# EAGLE design CC Debugger (EAGLE 6.4)
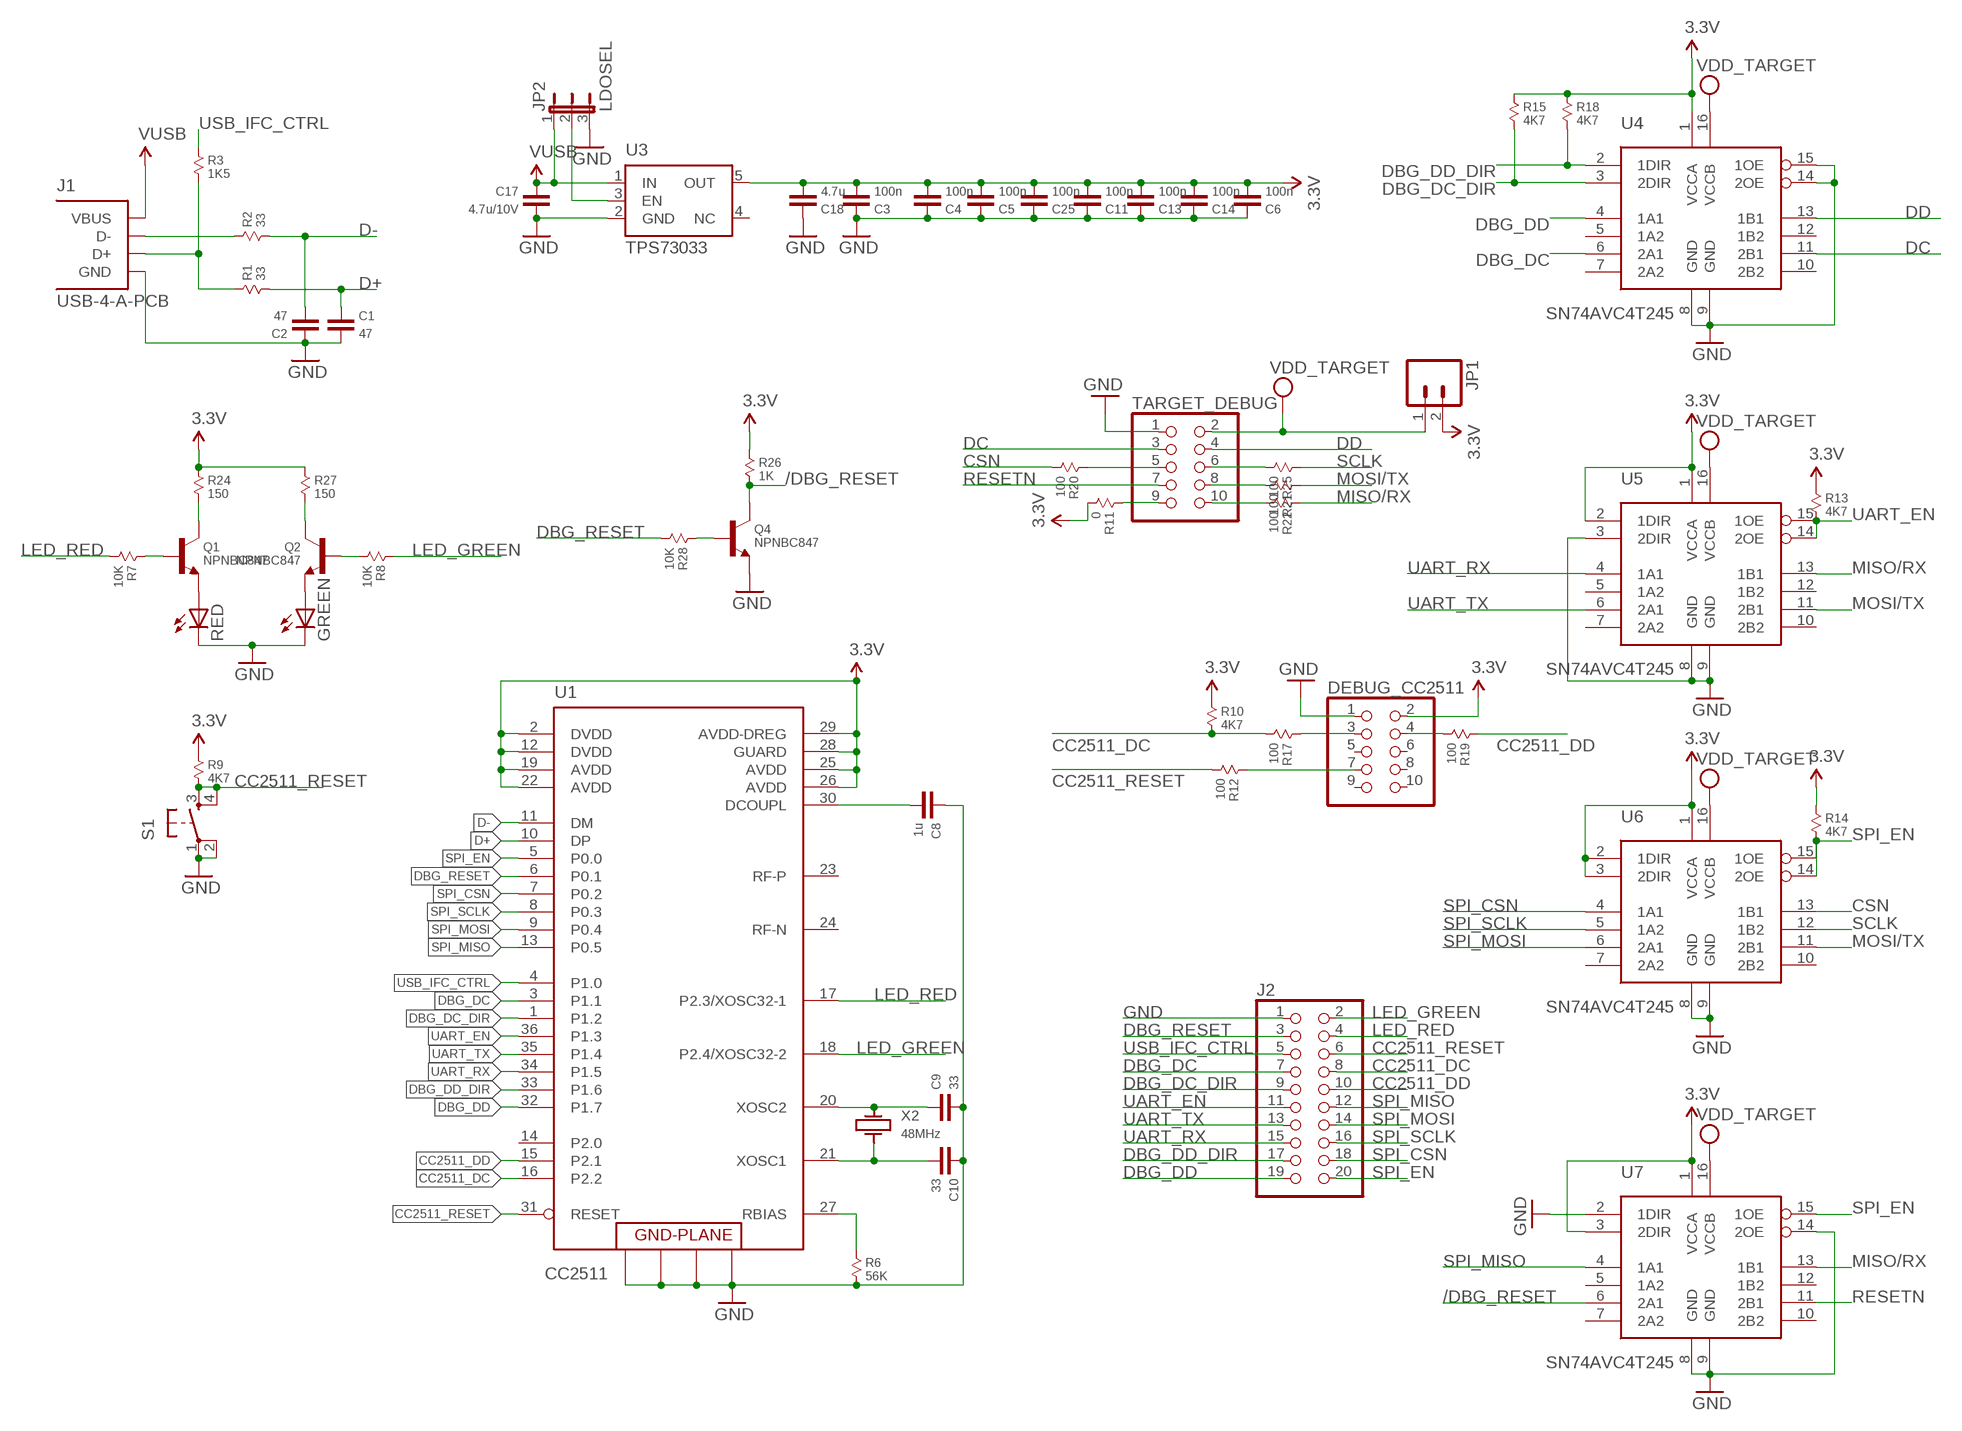
[diagram p0: schematic, sheet 1]

## Parts
C1  47  CAP-0603  [0603]
C2  47  CAP-0603  [0603]
C3  100n  CAP-0603  [0603]
C4  100n  CAP-0603  [0603]
C5  100n  CAP-0603  [0603]
C6  100n  CAP-0603  [0603]
C8  1u  CAP-0603  [0603]
C9  33  CAP-0603  [0603]
C10  33  CAP-0603  [0603]
C11  100n  CAP-0603  [0603]
C13  100n  CAP-0603  [0603]
C14  100n  CAP-0603  [0603]
C17  4.7u/10V  CAP-0603  [0603]
C18  4.7u  CAP-0603  [0603]
C25  100n  CAP-0603  [0603]
DEBUG_CC2511  PINHD-2X5  [2X05]
GREEN  LEDCHIPLED_0805  [CHIPLED_0805]
J1  USB-4-A-PCB  [USB-A-PCB]
J2  PINHD-2X10  [2X10]
JP1  M02PTH  [1X02]
JP2  LDOSEL  JUMPER-3SMD  [SJ_3]
Q1  NPNBC847  [SOT-23]
Q2  NPNBC847  [SOT-23]
Q4  NPNBC847  [SOT-23]
R1  33  RESISTOR-0603  [0603]
R2  33  RESISTOR-0603  [0603]
R3  1K5  RESISTOR-0603  [0603]
R6  56K  RESISTOR-0603  [0603]
R7  10K  RESISTOR-0603  [0603]
R8  10K  RESISTOR-0603  [0603]
R9  4K7  RESISTOR-0603  [0603]
R10  4K7  RESISTOR-0603  [0603]
R11  0  RESISTOR-0603  [0603]
R12  100  RESISTOR-0603  [0603]
R13  4K7  RESISTOR-0603  [0603]
R14  4K7  RESISTOR-0603  [0603]
R15  4K7  RESISTOR-0603  [0603]
R17  100  RESISTOR-0603  [0603]
R18  4K7  RESISTOR-0603  [0603]
R19  100  RESISTOR-0603  [0603]
R20  100  RESISTOR-0603  [0603]
R21  100  RESISTOR-0603  [0603]
R22  100  RESISTOR-0603  [0603]
R24  150  RESISTOR-0603  [0603]
R25  100  RESISTOR-0603  [0603]
R26  1K  RESISTOR-0603  [0603]
R27  150  RESISTOR-0603  [0603]
R28  10K  RESISTOR-0603  [0603]
RED  LEDCHIPLED_0805  [CHIPLED_0805]
S1  TAC_SWITCHPTH  [TACTILE-PTH]
TARGET_DEBUG  PINHD-2X5  [2X05]
U1  CC2511  [QLP-36]
U3  TPS73033  [SOT23-5]
U4  SN74AVC4T245  [TSSOP16]
U5  SN74AVC4T245  [TSSOP16]
U6  SN74AVC4T245  [TSSOP16]
U7  SN74AVC4T245  [TSSOP16]
X2  48MHz  CRYSTAL-KX-9A  [KX-9A]

## Nets
3.3V: C3.1 C4.1 C5.1 C6.1 C11.1 C13.1 C14.1 C18.1 C25.1 DEBUG_CC2511.2 JP1.2 R9.1 R10.1 R11.2 R13.1 R14.1 R15.1 R18.1 R24.1 R26.1 R27.1 U1.2(DVDD) U1.12(DVDD) U1.19(AVDD) U1.22(AVDD) U1.25(AVDD) U1.26(AVDD) U1.28(GUARD) U1.29(AVDD-DREG) U3.5(OUT) U4.1(VCCA) U5.1(VCCA) U5.2(1DIR) U6.1(VCCA) U6.2(1DIR) U6.3(2DIR) U7.1(VCCA) U7.3(2DIR)
5V: C17.2 J1.VUSB(VBUS) JP2.1 U3.1(IN) ; supply symbol labelled VUSB
/DBG_RESET: Q4.3(C) R26.2 U7.6(2A1)
CC2511_DC: J2.8 R10.2 R17.2 U1.16(P2.2)
CC2511_DD: J2.10 R19.1 U1.15(P2.1)
CC2511_RESET: J2.6 R9.2 R12.2 S1.3 S1.4 U1.31(RESET)
CSN: R20.2 U6.13(1B1)
D+: C1.2 R1.2 U1.10(DP)
D-: C2.1 R2.2 U1.11(DM)
DBG_DC: J2.7 U1.3(P1.1) U4.6(2A1)
DBG_DC_DIR: J2.9 R15.2 U1.1(P1.2) U4.3(2DIR)
DBG_DD: J2.19 U1.32(P1.7) U4.4(1A1)
DBG_DD_DIR: J2.17 R18.2 U1.33(P1.6) U4.2(1DIR)
DBG_RESET: J2.3 R28.2 U1.6(P0.1)
DC: TARGET_DEBUG.3 U4.11(2B1)
DD: TARGET_DEBUG.4 U4.13(1B1)
GND: C1.1 C2.2 C3.2 C4.2 C5.2 C6.2 C8.2 C9.1 C10.2 C11.2 C13.2 C14.2 C17.1 C18.2 C25.2 DEBUG_CC2511.1 GREEN.C J1.GND J2.1 JP2.3 Q4.2(E) R6.2 RED.C S1.1 S1.2 TARGET_DEBUG.1 U1.37(GND) U1.38(GND) U1.39(GND) U1.40(GND) U3.2(GND) U4.8(GND) U4.9(GND) U4.14(2OE) U4.15(1OE) U5.3(2DIR) U5.8(GND) U5.9(GND) U6.8(GND) U6.9(GND) U7.2(1DIR) U7.8(GND) U7.9(GND) U7.14(2OE)
LED_GREEN: J2.2 R8.1 U1.18(P2.4/XOSC32-2)
LED_RED: J2.4 R7.2 U1.17(P2.3/XOSC32-1)
MISO/RX: R22.1 U5.13(1B1) U7.13(1B1)
MOSI/TX: R21.1 U5.11(2B1) U6.11(2B1)
N$2: J1.D- R2.1
N$3: J1.D+ R1.1 R3.2
N$4: GREEN.A Q2.2(E)
N$5: Q1.2(E) RED.A
N$6: Q2.3(C) R27.2
N$7: Q1.3(C) R24.2
N$8: Q2.1(B) R8.2
N$9: DEBUG_CC2511.3 R17.1
N$10: Q1.1(B) R7.1
N$11: DEBUG_CC2511.7 R12.1
N$12: DEBUG_CC2511.4 R19.2
N$13: R25.2 TARGET_DEBUG.6
N$14: C9.2 U1.20(XOSC2) X2.1
N$15: R21.2 TARGET_DEBUG.8
N$16: R22.2 TARGET_DEBUG.10
N$17: C10.1 U1.21(XOSC1) X2.3
N$18: R6.1 U1.27(RBIAS)
N$19: C8.1 U1.30(DCOUPL)
N$20: R11.1 TARGET_DEBUG.9
N$21: R20.1 TARGET_DEBUG.5
N$22: Q4.1(B) R28.1
N$23: JP2.2 U3.3(EN)
RESETN: TARGET_DEBUG.7 U7.11(2B1)
SCLK: R25.1 U6.12(1B2)
SPI_CSN: J2.18 U1.7(P0.2) U6.4(1A1)
SPI_EN: J2.20 R14.2 U1.5(P0.0) U6.14(2OE) U6.15(1OE) U7.15(1OE)
SPI_MISO: J2.12 U1.13(P0.5) U7.4(1A1)
SPI_MOSI: J2.14 U1.9(P0.4) U6.6(2A1)
SPI_SCLK: J2.16 U1.8(P0.3) U6.5(1A2)
UART_EN: J2.11 R13.2 U1.36(P1.3) U5.14(2OE) U5.15(1OE)
UART_RX: J2.15 U1.34(P1.5) U5.4(1A1)
UART_TX: J2.13 U1.35(P1.4) U5.6(2A1)
USB_IFC_CTRL: J2.5 R3.1 U1.4(P1.0)
VDD: JP1.1 TARGET_DEBUG.2 U4.16(VCCB) U5.16(VCCB) U6.16(VCCB) U7.16(VCCB) ; supply symbol labelled VDD_TARGET
Unconnected: DEBUG_CC2511.5 DEBUG_CC2511.6 DEBUG_CC2511.8 DEBUG_CC2511.9 DEBUG_CC2511.10 U1.14(P2.0) U1.23(RF-P) U1.24(RF-N) U3.4(NC) U4.5(1A2) U4.7(2A2) U4.10(2B2) U4.12(1B2) U5.5(1A2) U5.7(2A2) U5.10(2B2) U5.12(1B2) U6.7(2A2) U6.10(2B2) U7.5(1A2) U7.7(2A2) U7.10(2B2) U7.12(1B2)

## Library data of the parts
C1-C6 C8-C11 C13 C14 C17 C18 C25 = X893:CAP: Capacitor
DEBUG_CC2511 TARGET_DEBUG = pinhead:PINHD-2X5: PIN HEADER
GREEN RED = led:LED: LED OSRAM: - CHIPLED LG R971, LG N971, LY N971, LG Q971, LY Q971, LO R971, LY R971 LH N974, LH R974 LS Q976, LO Q976, LY Q976 LO Q996 - Hyper CHIPLED LW Q18S LB Q993, LB Q99A, LB R99A - SideLED LS A670, LO A670, LY A670, LG A670, LP A670 LB A673, LV A673, LT A673, LW A673 LH A674 LY A675 LS A676, LA A676, LO A676, LY A676, LW A676 LS A679, LY A679, LG A679 - Hyper Micro SIDELED® LS Y876, LA Y876, LO Y876, LY Y876 LT Y87S - SmartLED LW L88C, LW L88S LB L89C, LB L89S, LG L890 LS L89K, LO L89K, LY L89K LS L896, LA L896, LO L896, LY L896 - TOPLED LS T670, LO T670, LY T670, LG T670, LP T670 LSG T670, LSP T670, LSY T670, LOP T670, LYG T670 LG T671, LOG T671, LSG T671 LB T673, LV T673, LT T673, LW T673 LH T674 LS T676, LA T676, LO T676, LY T676, LB T676, LH T676, LSB T676, LW T676 LB T67C, LV T67C, LT T67C, LS T67K, LO T67K, LY T67K, LW E67C LS E67B, LA E67B, LO E67B, LY E67B, LB E67C, LV E67C, LT E67C LW T67C LS T679, LY T679, LG T679 LS T770, LO T770, LY T770, LG T770, LP T770 LB T773, LV T773, LT T773, LW T773 LH T774 LS E675, LA E675, LY E675, LS T675 LS T776, LA T776, LO T776, LY T776, LB T776 LHGB T686 LT T68C, LB T68C - Hyper Mini TOPLED® LB M676 - Mini TOPLED Santana® LG M470 LS M47K, LO M47K, LY M47K Source: http://www.osram.convergy.de LUXEON: - LUMILED® LXK2-PW12-R00, LXK2-PW12-S00, LXK2-PW14-U00, LXK2-PW14-V00 LXK2-PM12-R00, LXK2-PM12-S00, LXK2-PM14-U00 LXK2-PE12-Q00, LXK2-PE12-R00, LXK2-PE12-S00, LXK2-PE14-T00, LXK2-PE14-U00 LXK2-PB12-K00, LXK2-PB12-L00, LXK2-PB12-M00, LXK2-PB14-N00, LXK2-PB14-P00, LXK2-PB14-Q00 LXK2-PR12-L00, LXK2-PR12-M00, LXK2-PR14-Q00, LXK2-PR14-R00 LXK2-PD12-Q00, LXK2-PD12-R00, LXK2-PD12-S00 LXK2-PH12-R00, LXK2-PH12-S00 LXK2-PL12-P00, LXK2-PL12-Q00, LXK2-PL12-R00 Source: www.luxeon.com KINGBRIGHT: KA-3528ASYC Source: www.kingbright.com
J1 = X893:USB-4: http://www.hirose.co.jp/cataloge_hp/e24200011.pdf
J2 = pinhead:PINHD-2X10: PIN HEADER
JP1 = SparkFun:M02: Header 2 Standard 2-pin 0.1" header. Use with straight break away headers (SKU : PRT-00116), right angle break away headers (PRT-00553), swiss pins (PRT-00743), machine pins (PRT-00117), and female headers (PRT-00115). Molex polarized connector foot print use with SKU : PRT-08233 with associated crimp pins and housings.
JP2 = SparkFun:JUMPER-3
Q1 Q2 Q4 = X893:NPN
R1-R3 R6-R15 R17-R22 R24-R28 = X893:RESISTOR
S1 = SparkFun:TAC_SWITCH: Momentary Switch Button commonly used for reset or general input. Spark Fun Electronics SKU : COM-00097
U1 = chipcon-ti:CC2511: True System-on-Chip with Low Power RF Transceiver and 8051 MCU 2.4 GHz ISM/SRD band systems Full-Speed USB Controller
U3 = X893:TPS73033: LOW-NOISE, HIGH PSRR, RF 200-mA LOW-DROPOUT LINEAR REGULATOR http://www.terraelectronica.ru/pdf/TI/TPS73033.pdf
U4-U7 = X893:SN74AVC4T245: 4-bit Dual supply bus transceiver http://focus.ti.com/lit/ds/symlink/sn74avc4t245.pdf
X2 = X893:CRYSTAL: Crystal

## Board
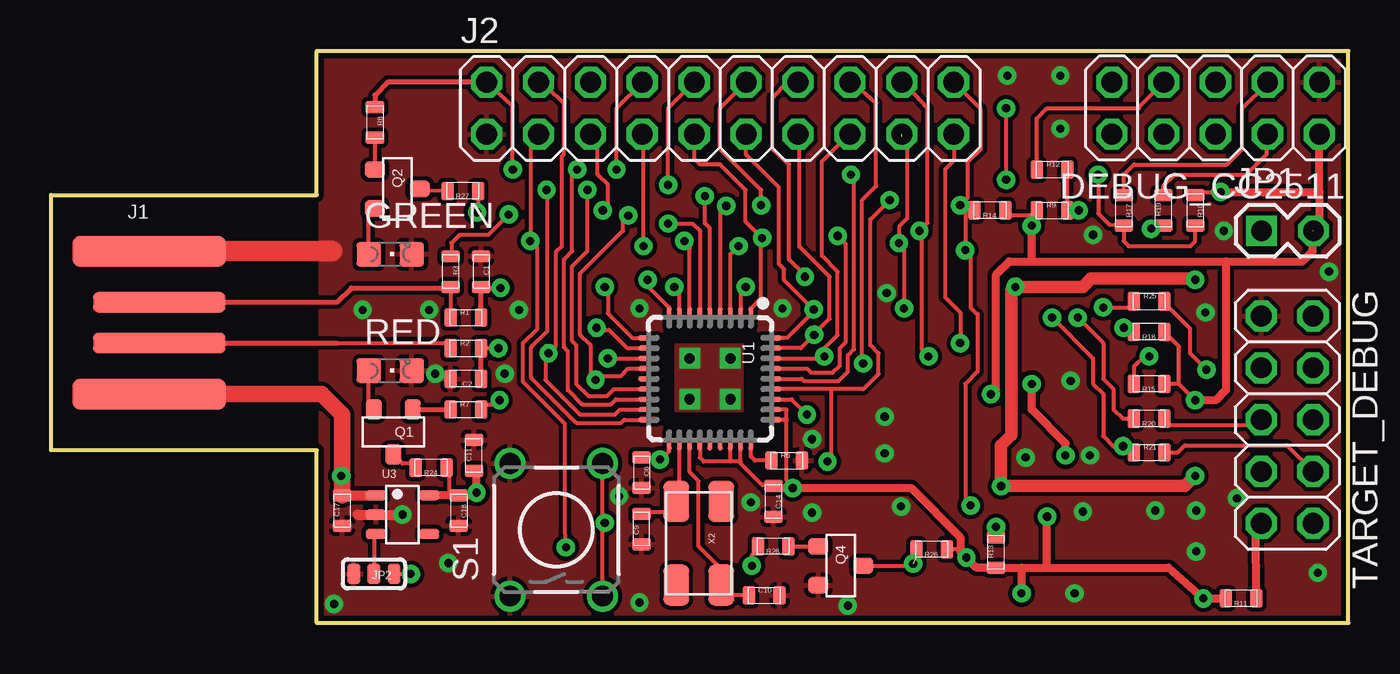
[diagram p1: board, top side]
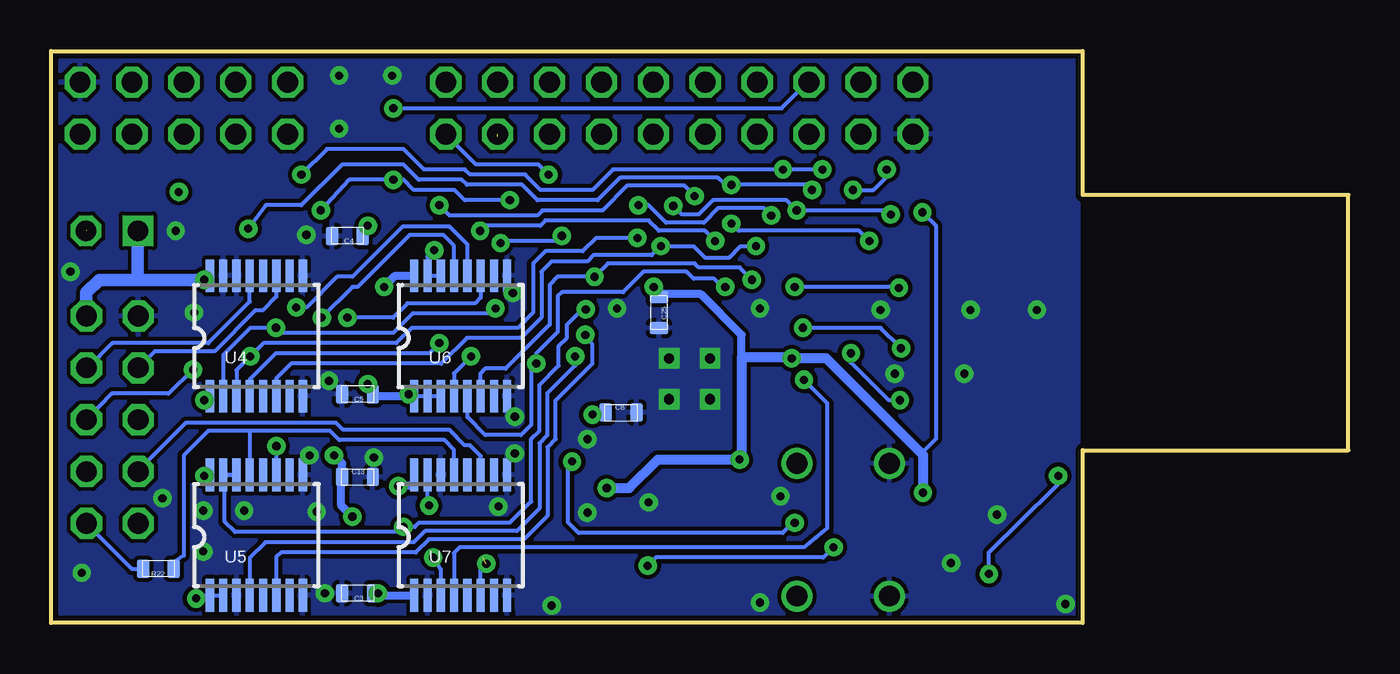
[diagram p2: board, bottom side, seen from below]

Size 63.5 x 28 mm. Coordinates in mm from the lower left corner, seen from the top.
Outline: 13,20.95 13,28 63.5,28 63.5,0 13,0 13,8.45
Copper layers (1*16): Top 0.035mm / dielectric 1.5mm / Bottom 0.035mm
Design rules "Rezonit *": minimum track width 0.2mm, minimum drill 0.4mm, track to track 0.2mm, track to pad 0.2mm, pad to pad 0.2mm, via to via 0.2mm, smd to smd 0mil, copper to edge 0.25mm, drill to drill 0.2mm, minimum pad ring 0.25mm, minimum via ring 0.25mm, stop-mask expansion 4mil, vias tented up to drill 0.4mm, thermal gap 0.2mm
tRestrict: 4 lines

### Footprints (pad centres in the part's own frame; a part is rotated, then mirrored left to right if it is on the bottom)
0603 = smd 0.6 x 0.9: 1 -0.75,0; 2 0.75,0
2X05 = drill 1.016 octagon: 1 -5.08,-1.27; 2 -5.08,1.27; 3 -2.54,-1.27; 4 -2.54,1.27; 5 0,-1.27; 6 0,1.27; 7 2.54,-1.27; 8 2.54,1.27; 9 5.08,-1.27; 10 5.08,1.27
CHIPLED_0805 = smd 1.2 x 1.2: A 0,-1.05; C 0,1.05
USB-A-PCB = smd 6.5 x 1: D+ -0.2,1; D- -0.2,-1 | smd 7.5 x 1.5: GND -0.7,3.5; VUSB -0.7,-3.5
2X10 = drill 1.016 octagon: 1 -11.43,-1.27; 2 -11.43,1.27; 3 -8.89,-1.27; 4 -8.89,1.27; 5 -6.35,-1.27; 6 -6.35,1.27; 7 -3.81,-1.27; 8 -3.81,1.27; 9 -1.27,-1.27; 10 -1.27,1.27; 11 1.27,-1.27; 12 1.27,1.27; 13 3.81,-1.27; 14 3.81,1.27; 15 6.35,-1.27; 16 6.35,1.27; 17 8.89,-1.27; 18 8.89,1.27; 19 11.43,-1.27; 20 11.43,1.27
1X02 = drill 1 pad 1.5 square: 1 0,0 | drill 1 pad 1.5 octagon: 2 2.54,0
SJ_3 = smd 0.635 x 1: 1 -0.99,0; 2 0,0; 3 0.99,0
SOT-23 = smd 0.8 x 1: 1 -0.95,-1.1; 2 0.95,-1.1; 3 0,1.1
TACTILE-PTH = drill 1.016: 1 -3.251,2.261; 2 3.251,2.261; 3 -3.251,-2.261; 4 3.251,-2.261
QLP-36 = smd 1 x 0.25: 1 -3,2; 2 -3,1.5; 3 -3,1; 4 -3,0.5; 5 -3,0; 6 -3,-0.5; 7 -3,-1; 8 -3,-1.5; 9 -3,-2; 19 3,-2; 20 3,-1.5; 21 3,-1; 22 3,-0.5; 23 3,0; 24 3,0.5; 25 3,1; 26 3,1.5; 27 3,2 | smd 0.25 x 1: 10 -2,-3; 11 -1.5,-3; 12 -1,-3; 13 -0.5,-3; 14 0,-3; 15 0.5,-3; 16 1,-3; 17 1.5,-3; 18 2,-3; 28 2,3; 29 1.5,3; 30 1,3; 31 0.5,3; 32 0,3; 33 -0.5,3; 34 -1,3; 35 -1.5,3; 36 -2,3 | drill 0.5 pad 0.85 square: 37 -1,1; 38 1,1; 39 -1,-1; 40 1,-1
SOT23-5 = smd 0.5 x 1: 1 -0.95,-1.3; 2 0,-1.3; 3 0.95,-1.3; 4 0.95,1.3; 5 -0.95,1.3
TSSOP16 = smd 0.4 x 1.6: 1 -2.225,-2.85; 2 -1.575,-2.85; 3 -0.925,-2.85; 4 -0.275,-2.85; 5 0.375,-2.85; 6 1.025,-2.85; 7 1.675,-2.85; 8 2.325,-2.85; 9 2.325,3.05; 10 1.675,3.05; 11 1.025,3.05; 12 0.375,3.05; 13 -0.275,3.05; 14 -0.925,3.05; 15 -1.575,3.05; 16 -2.225,3.05
KX-9A = smd 2 x 1.25: 1 -2.05,-1.1; 2 2.05,-1.1; 3 2.05,1.1; 4 -2.05,1.1

### Placement (x,y rotation side)
C1  21.05,17.2 270 top
C2  20.3,11.95 180 top
C3  48.5,1.45 180 bottom
C4  49,18.95 180 bottom
C5  48.5,11.2 180 bottom
C6  28.9,7.35 270 top
C8  35.6,10.3 0 bottom
C9  28.9,4.6 90 top
C10  34.9,1.35 0 top
C11  20.7,8.2 90 top
C13  48.5,7.15 0 bottom
C14  35.35,5.95 270 top
C17  14.25,5.5 90 top
C18  19.95,5.5 270 top
C25  33.75,15.2 270 bottom
DEBUG_CC2511  57,25.2 180 top
GREEN  16.6,18.05 270 top
J1  5.5,14.7 0 top
J2  32.75,25.2 0 top
JP1  59.25,19.2 0 top
JP2  15.8,2.4 180 top
Q1  16.75,9.35 180 top
Q2  16.95,21.25 270 top
Q4  38.65,2.8 270 top
R1  20.3,14.95 0 top
R2  20.3,13.45 0 top
R3  19.55,17.2 270 top
R6  36,7.95 0 top
R7  20.3,10.45 0 top
R8  15.85,24.5 270 top
R9  49,20.2 0 top
R10  56,20.2 270 top
R11  58.25,1.2 180 top
R12  49,22.2 0 top
R13  46.25,3.45 90 top
R14  45.95,20.2 180 top
R15  53.75,11.7 180 top
R17  52.5,20.2 270 top
R18  53.75,14.25 180 top
R19  54.45,20.2 90 top
R20  53.75,10 180 top
R21  53.75,8.35 0 top
R22  58.25,2.65 180 bottom
R24  18.6,7.6 180 top
R25  53.75,15.75 0 top
R26  43.1,3.6 180 top
R27  20.15,21.15 180 top
R28  35.35,3.75 180 top
RED  16.6,12.35 270 top
S1  24.73,4.56 90 top
TARGET_DEBUG  60.5,9.95 270 top
U1  32.25,11.95 270 top
U3  17.2,5.3 270 top
U4  53.5,13.95 0 bottom
U5  53.5,4.2 0 bottom
U6  43.5,13.95 0 bottom
U7  43.5,4.2 0 bottom
X2  31.7,3.9 270 top

### Tracks (layer width: path | path; a pad name or v marks a point on that pad's centre or on a via)
3.3V  (via drill 0.4)  (1 unrouted)
  Top 0.2: v48,19.45 48,19.95 | R9.1 48.25,19.95 48,19.95 | 55.2,11.7 R15.1 | v56,10.9 55.2,11.7 | U1.19 30.25,8.4 29.85,8 v29.8,8 29,8 29,8.2 C6.1 | v27.25,12.95 U1.12 | U1.2 33.75,16.2 v34,16.45 | R14.1 46.7,20.05 46.8,19.95 48,19.95 | R10.1 56.1,21.1 v57.25,21.1 | 33.75,7.9 U1.26 | 33.25,7.9 31.95,7.9 31.75,8.1 U1.22 | 33.75,7.9 33.25,7.9 | 33.25,7.9 U1.25 | U1.29 36,10.45 36,9.95 | 36,9.95 U1.28 | 44.5,3.6 R26.1 | 19.5,6.25 19.5,7.65 | 33.75,7.9 33.75,7.8 34.8,6.75 35.4,6.75 C14.1 | R18.1 55.2,13.53 55.2,11.7 | v36.3,6.6 36.3,6.7 36,7 36,9.95 | R27.1 20.9,20.15 v20.85,20.1
  Top 0.25: 19.5,7.65 R24.1
  Top 0.4: v48,11.7 48,10.45 49.65,8.8 v49.65,8.2 | R11.2 v56.4,1.2 54.7,2.7 48.75,2.7 | 62.08,21.1 62.08,19.49 JP1.2 | 62.08,21.1 DEBUG_CC2511.2 | v57.25,21.1 62.08,21.1 | v46,11.2 46.25,11.45 46.25,17.05 46.9,17.7 48,17.7 | 48,17.7 v48,19.45 | 48,17.7 57.5,17.7 | 57.5,17.7 61.25,17.7 61.75,18.2 61.75,19.2 | 48.75,2.7 v48.75,5.2 | 47.5,2.7 46.5,2.7 46.4,2.6 R13.1 45.3,2.7 v44.8,3.2 44.5,3.5 44.5,3.6 44.5,4.2 42.1,6.6 v36.3,6.6 35.4,6.6 35.4,6.75 | 47.5,2.7 48.75,2.7 | 47.5,2.7 v47.5,1.45 | U3.5 19.5,6.25 C18.1 20.6,6.25 v20.82,6.38 20.82,7.45 C11.1 | v56,10.9 57,10.9 57.5,11.4 57.5,17.7
  Bottom 0.2: U6.1 U6.2 U6.3 | 47.4,1.35 v47.5,1.45 C3.1 | U5.2 U5.1 56.25,1.35 v56.4,1.2 | v48,19.45 C4.1 | 33.77,16.07 34,16.05 v34,16.45 | v48,11.7 47.5,11.2 C5.1 47.55,11.1 | U7.3 44.42,2.62 v44.8,3.2 | v20.85,20.1 20.2,19.45 20.2,9 20.82,8.38 20.82,8.22
  Bottom 0.4: U4.1 56,11.1 v56,10.9 | 47.4,1.35 U7.1 | 47.55,11.1 U6.1 45.83,11.2 v46,11.2 | v48.75,5.2 49.3,5.75 49.3,7.2 C13.1 49.25,7.8 v49.65,8.2 | 33.77,16.07 C25.1 33.75,16.1 31.7,16.1 29.7,14.1 29.7,13 | v27.25,12.95 27.3,13
  Bottom 0.5: v27.25,12.95 25.55,12.95 20.82,8.22 v20.82,6.38 | 27.3,13 29.7,13 29.7,8.2 v29.8,8 33.8,8 35.2,6.6 v36.3,6.6
5V  (via drill 0.4)
  Top 0.2: JP2.1 v17.6,2.4 | 14.3,6.25 14.3,7.1 v14.2,7.2
  Top 0.5: U3.1 14.3,6.25 C17.2
  Top 0.8: J1.VUSB 13.25,11.2 14.25,10.2 C17.2
  Bottom 0.2: v17.6,2.4 17.6,3.45 14.4,6.6 14.25,6.75 14.25,7.2 v14.2,7.2
/DBG_RESET  (via drill 0.4)  (1 unrouted)
  Top 0.2: R26.2 42.35,3.2 | Q4.3 42.1,2.8 v42.2,2.9
  Bottom 0.2: U7.6 42.48,2.67 v42.2,2.9
CC2511_DC  (via drill 0.4)
  Top 0.2: J2.8 28.98,26.47 27.68,25.2 v27.68,22.2 | v25.75,22.2 25.5,21.95 25.5,18.2 25.1,17.8 25.1,13.5 25.3,13.3 25.3,11.4 26,10.7 27.4,10.7 27.65,10.95 U1.16 | R10.2 56,18.7 55.75,18.45 52.75,18.45 52.5,18.7 R17.2 51.8,19.5 51.25,20.05 v51.25,21.95
  Bottom 0.2: v51.25,21.95 50,23.2 46.25,23.2 45.25,22.2 43.25,22.2 43,21.95 40.3,21.95 39.55,21.2 37,21.2 36,22.2 v27.68,22.2 v25.75,22.2
CC2511_DD  (via drill 0.4)
  Top 0.2: v30.2,21.45 30.2,25.2 J2.10 | v26.25,21.2 26.25,18.2 25.5,17.45 25.5,13.8 25.7,13.6 25.7,11.7 26.3,11.1 27.2,11.1 27.55,11.45 U1.15 | R19.1 54.35,19.3 v53.85,19.3
  Bottom 0.2: v53.85,19.3 53,20.45 51.25,20.45 49.25,22.45 46.25,22.45 45.5,21.7 43.4,21.7 43.15,21.45 40.45,21.45 39.7,20.7 36.75,20.7 35.65,21.8 30.85,21.8 30.5,21.45 v30.2,21.45 26.5,21.45 v26.25,21.2
CC2511_RESET  (via drill 0.4)
  Top 0.2: R12.2 R9.2 49.85,19.95 49.75,20.45 50,20.2 v50.3,20.2 | v41.05,20.7 40.1,19.75 40.1,13.6 40.5,13.2 40.5,12.2 39.75,11.45 38.17,11.45 | v46.75,21.7 v46.75,25.2 | 26.99,4.9 S1.4 | S1.3 26.99,4.9 | 26.99,4.9 v27.1,4.9 | 38.17,11.45 U1.31 | 38.17,11.45 38.17,8.07 v38,7.9
  Bottom 0.2: v50.3,20.2 48.9,21.7 v46.75,21.7 46.25,21.7 45.75,21.2 43.75,21.2 43.25,20.7 v41.05,20.7 | J2.6 26.48,26.47 27.75,25.2 v46.75,25.2 | v27.1,4.9 27.2,4.9 27.7,4.4 37.67,4.4 38.2,4.92 38.2,7.7 v38,7.9
CSN  (via drill 0.4)
  Top 0.2: v50.25,14.95 51.5,13.7 51.5,11.95 52,11.45 52,10.45 52.45,10 R20.2
  Bottom 0.2: v50.25,14.95 48.75,16.45 48.5,16.45 45.95,19 44.3,19 43.77,18.48 U6.13
D+  (via drill 0.4)
  Top 0.2: U1.10 28.45,13.95 27.25,15.15 27.25,16.3 v27.1,16.45
  Top 0.25: R1.2 C1.2 21.4,16.4 v22,16.4
  Bottom 0.2: 22.25,16.45 v27.1,16.45
  Bottom 0.25: v22,16.4 22.25,16.45
D-  (via drill 0.4)
  Top 0.2: U1.11 28.2,13.45 27.3,14.35 26.8,14.35 v26.7,14.45 | R2.2 v21.9,13.45
  Top 0.25: C2.1 R2.2
  Bottom 0.2: v21.9,13.45 22.9,14.45 v26.7,14.45
DBG_DC  (via drill 0.4)
  Top 0.2: U1.3 33.25,18.05 v33.65,18.45 | v29,18.45 29,23.87 J2.7
  Bottom 0.2: U4.6 52.48,11.97 51.75,12.7 44.4,12.7 43.15,13.95 40.5,13.95 39.5,14.95 39.5,17.2 39,17.7 37.25,17.7 36.95,18 34.1,18 v33.65,18.45 32.05,18.45 31.5,17.9 30.3,17.9 29.75,18.45 v29,18.45
DBG_DC_DIR  (via drill 0.4)
  Top 0.2: v53.75,13.05 53.5,13.05 53,12.55 R15.2 | U1.1 34.25,15.4 34.75,15.9 34.75,18.9 v34.8,18.85 34,19.65 34,21.2 32.75,22.45 31.75,22.45 31.5,22.7 31.5,23.91 J2.9
  Bottom 0.2: U4.3 54.42,12.38 v53.75,13.05 53.1,13.7 46.6,13.7 45.85,14.45 40.65,14.45 39.9,15.2 39.9,17.6 39.3,18.2 37.48,18.2 36.83,18.85 v34.8,18.85
DBG_DD  (via drill 0.4)
  Top 0.2: J2.19 44.18,22.63 43.75,22.2 43.75,15.95 44.5,15.2 v44.5,13.7 | 39.25,21.85 v39.15,21.95 39.3,21.8 39.3,13.4 39,13.1 39,12.3 38.55,11.85 36.85,11.85 36.75,11.95 U1.32
  Bottom 0.2: U4.4 53.77,11.93 52.5,13.2 45,13.2 v44.5,13.7 | v39.15,21.95 39.65,22.45 42.7,22.45 J2.19
DBG_DD_DIR  (via drill 0.4)  (1 unrouted)
  Top 0.2: v52.5,14.45 52.75,14.2 53,14.2 R18.2 | v41.75,15.4 41.75,18.35 v41.5,18.6 41.5,19.4 41.9,19.8 41.9,23.55 41.64,23.81 | v38.5,18.95 38.9,18.55 38.9,13.75 38.6,13.45 38.6,12.6 38.25,12.25 37.2,12.25 37,12.45 U1.33
  Bottom 0.2: U4.2 55.08,13.12 53.75,14.45 v52.5,14.45 52.25,14.2 46.75,14.2 45.8,15.15 42,15.15 v41.75,15.4 | v41.5,18.6 41.4,18.7 38.75,18.7 v38.5,18.95
DBG_RESET  (via drill 0.4)
  Top 0.2: 23.75,23.82 J2.3 23.5,23.57 23.5,18.9 23.45,18.75 v23.45,18.7 23.8,18.35 23.8,14.4 23.1,13.7 23.1,11.8 25.15,9.75 25.15,4.55 v25.2,3.7 | v34.3,2.8 34.3,3.3 34.6,3.6 R28.2 | U1.6 31.75,19.2 31.4,19.55 v30.2,19.55
  Bottom 0.2: v30.2,19.55 29.85,19.2 23.95,19.2 v23.45,18.7 | v25.2,3.7 25.7,3.2 33.9,3.2 v34.3,2.8
DC
  Bottom 0.2: U4.11 52.48,15.97 53.15,15.3 53.5,15.3 55.5,13.3 58.42,13.3 TARGET_DEBUG.3
DD
  Bottom 0.2: U4.13 53.77,15.72 55.8,13.7 60.5,13.7 61.71,12.49 TARGET_DEBUG.4
GND  (via drill 0.4)
  Top 0.5: 15,5.3 v17.2,5.3
  Top 1: J1.GND 13.75,18.2
  Bottom 0.2: U5.3 54.42,1.38 54.5,1.45 54.5,1.7 | U7.8 41.1,1.35 | U6.8 41.1,11.1
  other vias: 50.1,1.45 49.9,11.85 47.7,8.1 39,0.85 40.9,16.15 40.8,8.3 40.8,10.1 15.25,15.32 18.5,15.32 50.5,5.45 54.05,5.5 56.5,15.2 62.55,17.2 62,2.45 34.25,5.9 35.8,15.4 37.25,5.4 50.85,8.2 28.8,15.4 49.4,26.8 46.8,26.8 49.4,24.2 51,19 57.4,19.2 56.05,5.5 56.05,3.5 58.05,6.1 13.85,0.93 19.45,2.92 18.8,12.2 37.25,9 27.8,6.2 28.8,1 22.9,15.32 22.2,12.2 41.6,5.7
  pour Bottom (isolate 0.2): 13.2,28 63.5,28 63.5,0 13.2,0
  pour Top (isolate 0.2): 13.2,28 63.5,28 63.5,0 13.2,0
LED_GREEN  (via drill 0.4)
  Top 0.2: v22.6,22.2 22.6,25.29 J2.2 | U1.18 28.05,9.95 27.9,9.8 25.7,9.8 23.5,12 23.5,13.5 24.3,14.3 24.3,21.15 v24.25,21.2
  Top 0.25: J2.2 16.47,26.47 15.85,25.85 R8.1
  Bottom 0.2: v22.6,22.2 22.5,21.95 23.25,21.2 v24.25,21.2 | J2.2 21.3,26.45
LED_RED  (via drill 0.4)
  Top 0.2: J2.4 23.98,26.47 25.1,25.45 25.1,22.95 25,22.85 25,18.45 24.7,18.15 24.7,13.55 v24.35,13.2 24.2,13.05 24.2,11.9 25.9,10.2 27.6,10.2 27.85,10.45 U1.17 | R7.2 21.3,10.7 21.7,10.7 21.8,10.8 v21.95,10.9
  Bottom 0.2: J2.4 23.86,26.31 | v21.95,10.9 22.5,10.9 24.35,12.75 v24.35,13.2
MISO/RX
  Bottom 0.2: U7.13 43.77,8.47 44.25,8.95 49.4,8.95 49.85,9.4 53.77,9.4 | 53.77,9.4 U5.13 | R22.1 57.6,2.9 57,3.3 57,8.2 55.8,9.4 53.8,9.4 53.77,9.4
MOSI/TX  (via drill 0.4)
  Top 0.2: v49,14.95 51,12.95 51,11.7 51.5,11.2 51.5,9.15 52,8.65 v52.48,8.65 R21.1
  Bottom 0.2: v52.48,8.65 U5.11 | U6.11 42.48,15.93 42.75,15.65 46.05,15.65 46.75,14.95 v49,14.95
N$2
  Top 0.2: 14,13.7 19.5,13.7 R2.1
  Top 0.25: J1.D- 14,13.7
N$3
  Top 0.2: R3.2 R1.1
  Top 0.25: J1.D+ 14,15.7 14.7,16.4 19.4,16.4 R3.2
N$4
  Top 0.2: Q2.2 15.55,20 GREEN.A
N$5
  Top 0.2: 15.7,10.55 15.55,10.7 RED.A
  Top 0.25: Q1.2 15.7,10.55
N$6
  Top 0.2: Q2.3 18.12,21.18 R27.2
N$7
  Top 0.2: R24.2 18,7.8 17.2,7.8 Q1.3
N$8
  Top 0.2: Q2.1 R8.2
N$9
  Top 0.2: DEBUG_CC2511.3 59.54,26.41 58.3,25.2 58.3,23.2 57.55,22.45 53,22.45 52.5,21.95 R17.1
N$10
  Top 0.25: R7.1 17.8,10.45 17.8,10.65 Q1.1
N$11
  Top 0.2: DEBUG_CC2511.7 53.25,25.26 53.25,25.2 48.75,25.2 48.25,24.7 48.25,22.35 R12.1
N$12
  Top 0.2: DEBUG_CC2511.4 59.54,23.74 59.5,23.7 59.5,22.95 58.5,21.95 55,21.95 54.45,21.4 R19.2
N$13  (via drill 0.4)
  Top 0.2: R25.2 54.6,15.8 54.65,15.85 54.65,15.5 55.75,14.4 55.75,13.2 v56.55,12.4
  Bottom 0.2: v56.55,12.4 57.75,11.23 60.52,11.23 TARGET_DEBUG.6
N$14
  Top 0.2: U1.20 30.75,5.9 X2.1 30.4,5.85 | 30.4,5.85 30.5,6.7 | 30.4,5.85 30.25,5.85 30.2,5.4 28.95,5.4 C9.2
N$15
  Top 0.2: TARGET_DEBUG.8 60.48,8.7 55.5,8.7 55.15,8.35 R21.2
N$16
  Bottom 0.2: 59.25,2.65 R22.2 59.55,2.65 TARGET_DEBUG.10
N$17
  Top 0.2: U1.21 31.25,7.4 31.7,6.95 31.7,3.75 32.6,2.85 X2.3 | X2.3 32.6,1.8 | C10.1 33.1,1.35 X2.3
N$18
  Top 0.2: R6.1 34.45,7.95 34.25,8.15 U1.27
N$19  (via drill 0.4)
  Top 0.2: U1.30 36.25,10.95 v37,10.2
  Bottom 0.2: v37,10.2 C8.1
N$20
  Top 0.4: R11.1 58.98,4.62 TARGET_DEBUG.9
N$21
  Top 0.2: R20.1 54.5,9.7 58.98,9.7 TARGET_DEBUG.5
N$22
  Top 0.2: R28.1 Q4.1
N$23
  Top 0.2: U3.3 15.85,4.35 15.8,4.4 JP2.2
RESETN
  Bottom 0.2: TARGET_DEBUG.7 59.23,7.47 56.9,9.8 49.55,9.8 49.2,9.45 44,9.45 43.25,8.7 43,8.7 42.48,8.18 U7.11
SCLK  (via drill 0.4)
  Top 0.2: v51.5,15.45 52.85,15.45 53,15.6 R25.1
  Bottom 0.2: U6.12 43.12,18.52 44,19.4 46.3,19.4 48.75,16.95 49.5,16.95 51,15.45 v51.5,15.45
SPI_CSN  (via drill 0.4)
  Top 0.2: J2.18 41.73,26.47 42.9,25.2 42.9,19.6 v42.5,19.2 42.6,19.1 42.6,13.4 v42.95,13.05 | U1.7 31.25,18.35 31,18.6 v31,18.7
  Bottom 0.2: U6.4 43.77,12.22 v42.95,13.05 | v42.5,19.2 42.25,19.45 39.55,19.45 39.3,19.7 34.25,19.7 33.75,19.2 31.5,19.2 v31,18.7
SPI_EN  (via drill 0.4)
  Top 0.2: J2.20 45.5,25.15 45.5,23.2 44.85,22.55 44.85,20.8 v44.5,20.45 | v45,5.75 44.75,6 44.75,11.7 45.35,12.3 45.35,15.1 45,15.45 45,18 v44.75,18.25 44.75,20.25 v44.5,20.45 | U1.5 32.25,19.32 32,19.57 v32,20.9 | R14.2 44.75,20.2 v44.5,20.45
  Bottom 0.2: U6.14 U6.15 45.08,17.93 v44.75,18.25 | U7.15 45.08,5.83 v45,5.75 | v44.5,20.45 44,19.95 39.7,19.95 39.45,20.2 36.5,20.2 35.3,21.4 32.5,21.4 v32,20.9
SPI_MISO  (via drill 0.4)
  Top 0.2: J2.12 32.75,25.2 32.75,23.2 34.75,21.2 v34.75,20.45 | v28.25,19.95 28,19.7 28,19.2 25.9,17.1 25.9,14.1 26.4,13.6 26.4,12.15 v26.65,11.9 26.85,12.1 27.9,12.1 28.25,12.45 U1.13
  Bottom 0.2: U7.4 43.77,3.42 43.5,3.7 26.65,3.7 25.5,4.65 25.5,10.75 v26.65,11.9 | v28.25,19.95 28.6,20.3 30.85,20.3 31.55,19.6 33.4,19.6 34.25,20.45 v34.75,20.45
SPI_MOSI  (via drill 0.4)
  Top 0.2: U1.9 30.25,15.45 29.2,16.5 v29.2,16.8 | J2.14 36.02,26.47 35.3,25.7 35.3,23.2 36.12,22.45 36.12,17.8 36.9,17.02 v36.9,16.95
  Bottom 0.2: v29.2,16.8 29.8,17.4 31.8,17.4 32,17.6 36.25,17.6 v36.9,16.95 38.7,16.95 39.1,16.55 39.1,14.6 41.25,12.45 42.25,12.45 42.5,12.2 42.5,11.12 U6.6
SPI_SCLK  (via drill 0.4)
  Top 0.2: U1.8 30.75,16.2 v30.5,16.45 | J2.16 39.23,26.47 40.38,25.45 40.38,21.38 39.7,20.7 39.7,12.75 v39.75,12.7
  Bottom 0.2: U6.5 43.12,10.07 42.25,9.2 40.5,9.2 40,9.7 40,12.45 v39.75,12.7 39.75,13.2 38.7,14.25 38.7,16 38.5,16.2 35.5,16.2 34.5,17.2 32.4,17.2 32.05,16.85 31.05,16.85 30.6,16.4 v30.5,16.45
UART_EN  (via drill 0.4)
  Top 0.2: U1.36 36.02,13.95 36.7,14.62 37.3,15.2 37.33,15.22 v37.33,15.35 35.88,16.8 35.88,17.32 35.62,17.57 35.62,21.32 34.02,22.93 J2.11 | v46.25,4.7 R13.2
  Bottom 0.2: U5.15 U5.14 54.95,7.25 55,7.2 55,4.95 54.5,4.45 46.25,4.45 46,4.7 | v37.33,15.35 37.5,15.35 38.25,14.6 38.25,13.95 38.65,13.55 38.65,12.6 39.6,11.65 39.6,9.4 40,9 40,5.95 41.05,4.9 45.5,4.9 45.7,4.7 46,4.7 | 46,4.7 v46.25,4.7
UART_RX  (via drill 0.4)
  Top 0.2: J2.15 39.08,23.95 39.1,23.95 37.73,22.57 37.73,17.98 38.5,17.2 38.5,14.1 37.85,13.45 v37.85,13.05 37.75,12.95 U1.34
  Bottom 0.2: U5.4 53.77,3.17 53,3.95 45.75,3.95 45.2,4.5 40.7,4.5 39.6,5.6 39.6,8.8 39.2,9.2 39.2,11.25 37.85,12.6 v37.85,13.05
UART_TX  (via drill 0.4)
  Top 0.2: J2.13 36.62,23.75 36.62,18.43 38.1,16.95 38.1,14.9 37.4,14.2 v37.35,14.1 36.7,13.45 U1.35
  Bottom 0.2: U5.6 52.48,3.23 52.25,3.45 45.65,3.45 45,4.1 40.35,4.1 39.2,5.25 39.2,8.6 38.8,9 38.8,10.9 37,12.7 37,13.65 v37.35,14.1
USB_IFC_CTRL  (via drill 0.4)
  Top 0.2: U1.4 32.75,20.12 v33.05,20.43 | J2.5 26.4,23.8 26.75,23.45 26.75,21.95 27.25,21.45 27.25,20.45 v27,20.2 | v22.4,20 21.4,19 20,19 19.6,18.6 19.6,18 R3.1
  Bottom 0.2: v33.05,20.43 32.62,20 31.8,20 31.1,20.7 27.5,20.7 v27,20.2 22.6,20.2 v22.4,20
VDD  (via drill 0.4)
  Top 0.6: v56,7.2 55.5,6.7 v46.5,6.7 46.5,8.7 47,9.2 47,16.3 47.15,16.45 v47.2,16.45 50.5,16.45 50.9,16.85 55.95,16.85 v56,16.8
  Bottom 0.2: v56,7.2 U5.16 | v56,16.8 55.75,17.23 U4.16
  Bottom 0.4: U7.16 45.75,6.7 v46.5,6.7 | U6.16 46.65,17 v47.2,16.45
  Bottom 0.6: TARGET_DEBUG.2 61.77,16.18 61.15,16.8 59.25,16.8 | v56,16.8 59.25,16.8 | 59.25,16.8 JP1.1